# Altium schematic sheet tileMap.SCHDOC: LiveDesign Evaluation - Video Games
size A; Organization: Altium Limited; Address1: L3, 12a Rodborough Rd; Address2: Frenchs Forest; Address3: NSW; Address4: Australia 2086; DocumentNumber: 6; SheetNumber: 6; SheetTotal: 13
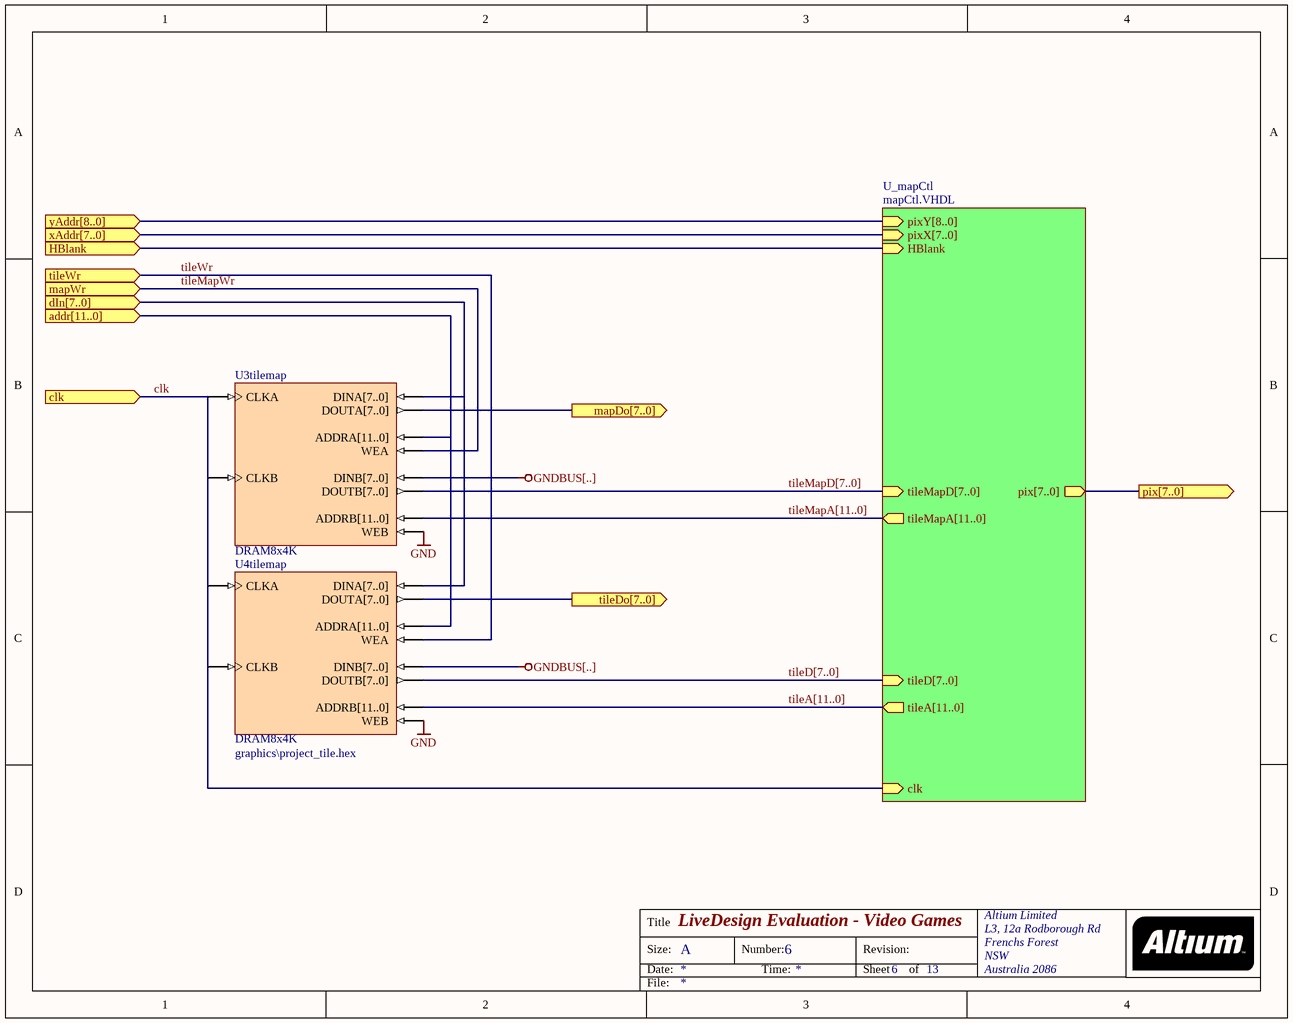
[diagram p0: tileMap.SCHDOC]

## Parts
U3tilemap  DRAM8x4K
U4tilemap  DRAM8x4K  Memory_ContentFile: graphics\project_tile.hex

## Sub-sheets
U_mapCtl = mapCtl.VHDL: clk (in), pix[7..0] (out), HBlank (in), pixX[7..0] (in), pixY[8..0] (in), tileA[11..0] (out), tileD[7..0] (in), tileMapA[11..0] (out), tileMapD[7..0] (in)  | VHDLENTITY: mapctl

## Ports
addr[11..0] (in), clk (in), dIn[7..0] (in), HBlank (in), mapDo[7..0] (out), mapWr (in), pix[7..0] (out), tileDo[7..0] (out), tileWr (in), xAddr[7..0] (in), yAddr[8..0] (in)

## Nets
GND: U3tilemap.WEB U4tilemap.WEB
GNDBUS[..]: U3tilemap.DINB[7..0] U4tilemap.DINB[7..0]
addr[11..0]: U3tilemap.ADDRA[11..0] U4tilemap.ADDRA[11..0] ; port addr[11..0]
clk: U3tilemap.CLKA U3tilemap.CLKB U4tilemap.CLKA U4tilemap.CLKB ; port clk, sheet U_mapCtl/clk
dIn[7..0]: U3tilemap.DINA[7..0] U4tilemap.DINA[7..0] ; port dIn[7..0]
HBlank: port HBlank, sheet U_mapCtl/HBlank
mapDo[7..0]: U3tilemap.DOUTA[7..0] ; port mapDo[7..0]
tileA[11..0]: U4tilemap.ADDRB[11..0] ; sheet U_mapCtl/tileA[11..0]
tileD[7..0]: U4tilemap.DOUTB[7..0] ; sheet U_mapCtl/tileD[7..0]
tileDo[7..0]: U4tilemap.DOUTA[7..0] ; port tileDo[7..0]
tileMapA[11..0]: U3tilemap.ADDRB[11..0] ; sheet U_mapCtl/tileMapA[11..0]
tileMapD[7..0]: U3tilemap.DOUTB[7..0] ; sheet U_mapCtl/tileMapD[7..0]
tileMapWr: U3tilemap.WEA ; port mapWr
tileWr: U4tilemap.WEA ; port tileWr

## Buses and harness runs
bus port pix[7..0] = sheet U_mapCtl/pix[7..0]
bus port xAddr[7..0] = sheet U_mapCtl/pixX[7..0]
bus port yAddr[8..0] = sheet U_mapCtl/pixY[8..0]
bus tileA[11..0] = sheet U_mapCtl/tileA[11..0]
bus tileD[7..0] = sheet U_mapCtl/tileD[7..0]
bus tileMapA[11..0] = sheet U_mapCtl/tileMapA[11..0]
bus tileMapD[7..0] = sheet U_mapCtl/tileMapD[7..0]

## Notes on the sheet
- Labels drawn without touching a wire or pin: GNDBUS[..]
- Title
- Size:
- Date:
- A
- Number:
- Time:
- Revision:
- Sheet
- of
- File:

## Library data of the parts
U3tilemap U4tilemap = DRAM8x4K: Dual Port Random Access Memory 4096 x 8 and 4096 x 8; Memory_DepthA: 4096; Memory_Type: RAM_DualPortBlock; Memory_WidthA: 8; Memory_ClockEdge: Rising; Nexus_Core: Memory_Program; Published: 26/09/2003; Publisher: Altium Hobart Technology Center; Memory_DepthB: 4096; Memory_WidthB: 8